# Altium schematic sheet [6]Battery Managment.SchDoc
size B
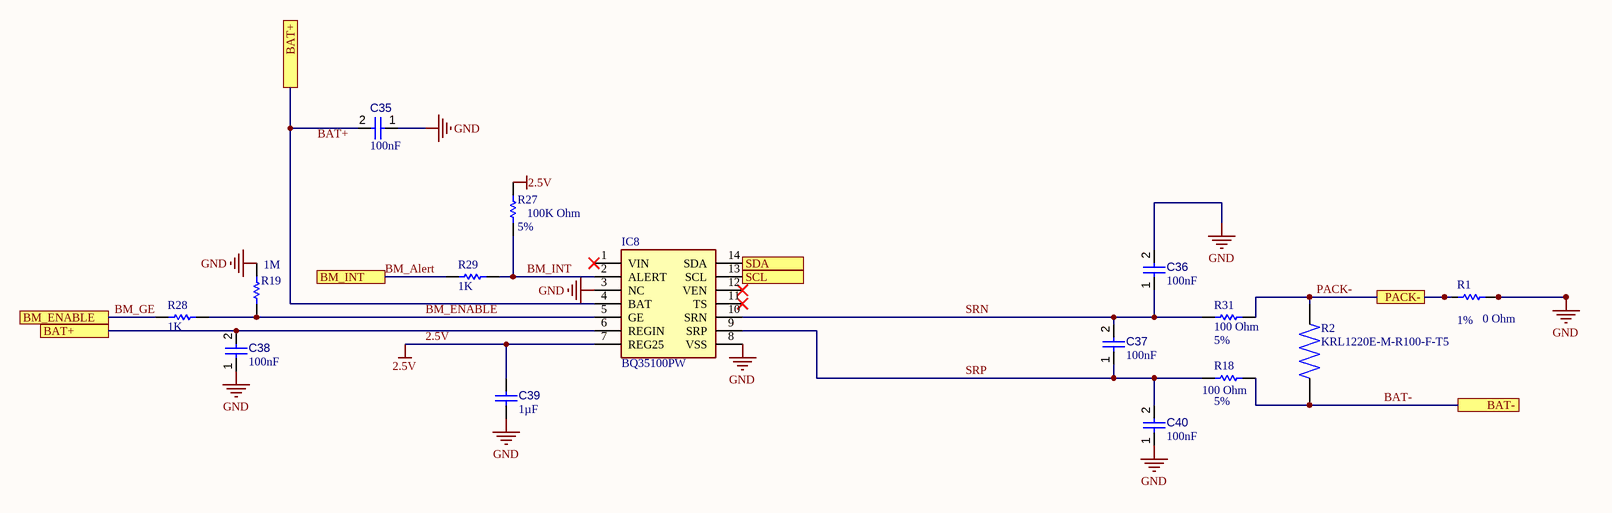
[diagram p0: [6]Battery Managment.SchDoc]

## Parts
C35  value 100nF  [CAPC1608X90X40ML10T20]  (hidden comment: Capacitor 100 nF +/-10% 50 V 0603)
C36  value 100nF  [CAPC1608X90X40ML10T20]  (hidden comment: Capacitor 100 nF +/-10% 50 V 0603)
C37  value 100nF  [CAPC1608X90X40ML10T20]  (hidden comment: Capacitor 100 nF +/-10% 50 V 0603)
C38  value 100nF  [CAPC1608X90X40ML10T20]  (hidden comment: Capacitor 100 nF +/-10% 50 V 0603)
C39  value 1µF  [CAPC1608X90X40ML10T20]  (hidden comment: Capacitor 1 uF +/- 10% 25 V 0603)
C40  value 100nF  [CAPC1608X90X40ML10T20]  (hidden comment: Capacitor 100 nF +/-10% 50 V 0603)
IC8  BQ35100PW  [SOP65P640X120-14N]
R1  value 0 Ohm  Tolerance: 1%  [RESC0603]  (hidden comment: 0)
R2  KRL1220E-M-R100-F-T5  [RESC2012X70N]
R18  Tolerance: 5%  [RES 0603]  (hidden comment: 100 Ohm)
R19  1M  [RES 0603]
R27  value 100K Ohm  Tolerance: 5%  [RES 0603]  (hidden comment: RES 100K 5% 0.1W [0603])
R28  1K  [RES 0603]
R29  1K  [RES 0603]
R31  Tolerance: 5%  [RES 0603]  (hidden comment: 100 Ohm)

## Ports
BAT+, BAT-, BM_ENABLE, BM_INT, PACK-, SCL, SDA

## Nets
2.5V: C39.1 IC8.7(REG25) R27.2
GND: C35.1 C36.2 C38.1 C39.2 C40.1 IC8.3(NC) IC8.8(VSS) R1.2 R19.2
BAT+: C35.2 C38.2 IC8.4(BAT) IC8.6(REGIN) ; port BAT+
BAT-: R2.1 R18.1 ; port BAT-
BM_Alert: R29.2 ; port BM_INT
BM_ENABLE: IC8.5(GE) R19.1 R28.1
BM_GE: R28.2 ; port BM_ENABLE
BM_INT: IC8.2(ALERT) R27.1 R29.1
PACK-: R1.1 R2.2 R31.1 ; port PACK-
SCL: IC8.13(SCL) ; port SCL
SDA: IC8.14(SDA) ; port SDA
SRN: C36.1 C37.2 IC8.10(SRN) R31.2
SRP: C37.1 C40.2 IC8.9(SRP) R18.2

Not connected (* = marked no-connect by the designer): IC8 1(VIN)* 11(TS)* 12(VEN)*

## Notes on the sheet
- Labels drawn without touching a wire or pin: BAT+

## Library data of the parts
C35-C38 C40 = CMP-001-00017-4: Chip Capacitor, 100 nF, +/- 10%, 50 V, 0603 (1608 Metric); Capacitor Type: Ceramic; Voltage Rating: 50V; RoHS Compliant: True; Max Operating Temperature: 125°C; Pins: 2; Mounting Technology: SM; Min Operating Temperature: -55°C; Tolerance: 10%; Case/Package: 0603
C39 = CMP-001-00005-4: Chip Capacitor, 1 uF, +/- 10%, 25 V, 0603 (1608 Metric); Voltage Rating: 25V; Capacitor Type: Ceramic; Min Operating Temperature: -55°C; Tolerance: 10%; Max Operating Temperature: 125°C; Case/Package: 0603; RoHS Compliant: True; Mounting Technology: SM; Pins: 2
IC8 = BQ35100PW: Integrated Circuit; Manufacturer_Name: Texas Instruments; Datasheet Link: http://www.ti.com/lit/gpn/bq35100; Height: 1.2mm; Manufacturer_Part_Number: BQ35100PW; Arrow Part Number: BQ35100PW; Arrow Price/Stock: https://www.arrow.com/en/products/bq35100pw/texas-instruments; Mouser Part Number: 595-BQ35100PW; Mouser Price/Stock: https://www.mouser.co.uk/ProductDetail/Texas-Instruments/BQ35100PW?qs=Jwe3UnxISIaIuldqtot6tg%3D%3D
R1 = RES 0 Ohm [0603]: RES 0 Ohm 1% 0.1W [0603]; Supplier 1: Mouser; Supplier Part Number 1: 667-ERJ-3GEY0R00V; Datasheet: http://industrial.panasonic.com/cdbs/www-data/pdf/RDA0000/AOA0000C301.pdf?src-supplier=Farnell
R2 = KRL1220E-M-R100-F-T5: 0.1 Ohm current sense resistor; Package: None; Price: None; Value: *; MP: KRL1220E-M-R100-F-T5; Availability: Unavailable
R18 R31 = RES 3.3M 1% 0.1W [0603]: RES 100 Ohm 5% 0.1W [0603]; PN: CRCW06033M30FKEA; Supplier 1: Digi-Key; Supplier Part Number 1: 541-3.30MHCT-ND; Value: 100 Ohm
R19 = RES 3.3M 1% 0.1W [0603]: 1M 1% 0.1W [0603]; Supplier 1: Digi-Key; Supplier Part Number 1: 541-3.30MHCT-ND; Value: 1M; Tolerance: 1%
R27 = RES 1M 1% 0.1W [0603]: PN: CR0603-FX-1004ELF; Supplier 1: Mouser; Supplier Part Number 1: 652-CR0603FX-1004ELF; Datasheet: https://uk.rs-online.com/webdocs/0fcd/0900766b80fcdb72.pdf?src-supplier=RSComponents; Power: 0.1W
R28 R29 = RES 3.3M 1% 0.1W [0603]: 1K 1% 0.1W [0603]; Value: 1M; Supplier 1: Digi-Key; Supplier Part Number 1: 541-3.30MHCT-ND; Tolerance: 1%